# EAGLE design PCBprototyp-Rev3 (EAGLE 9.6.2)
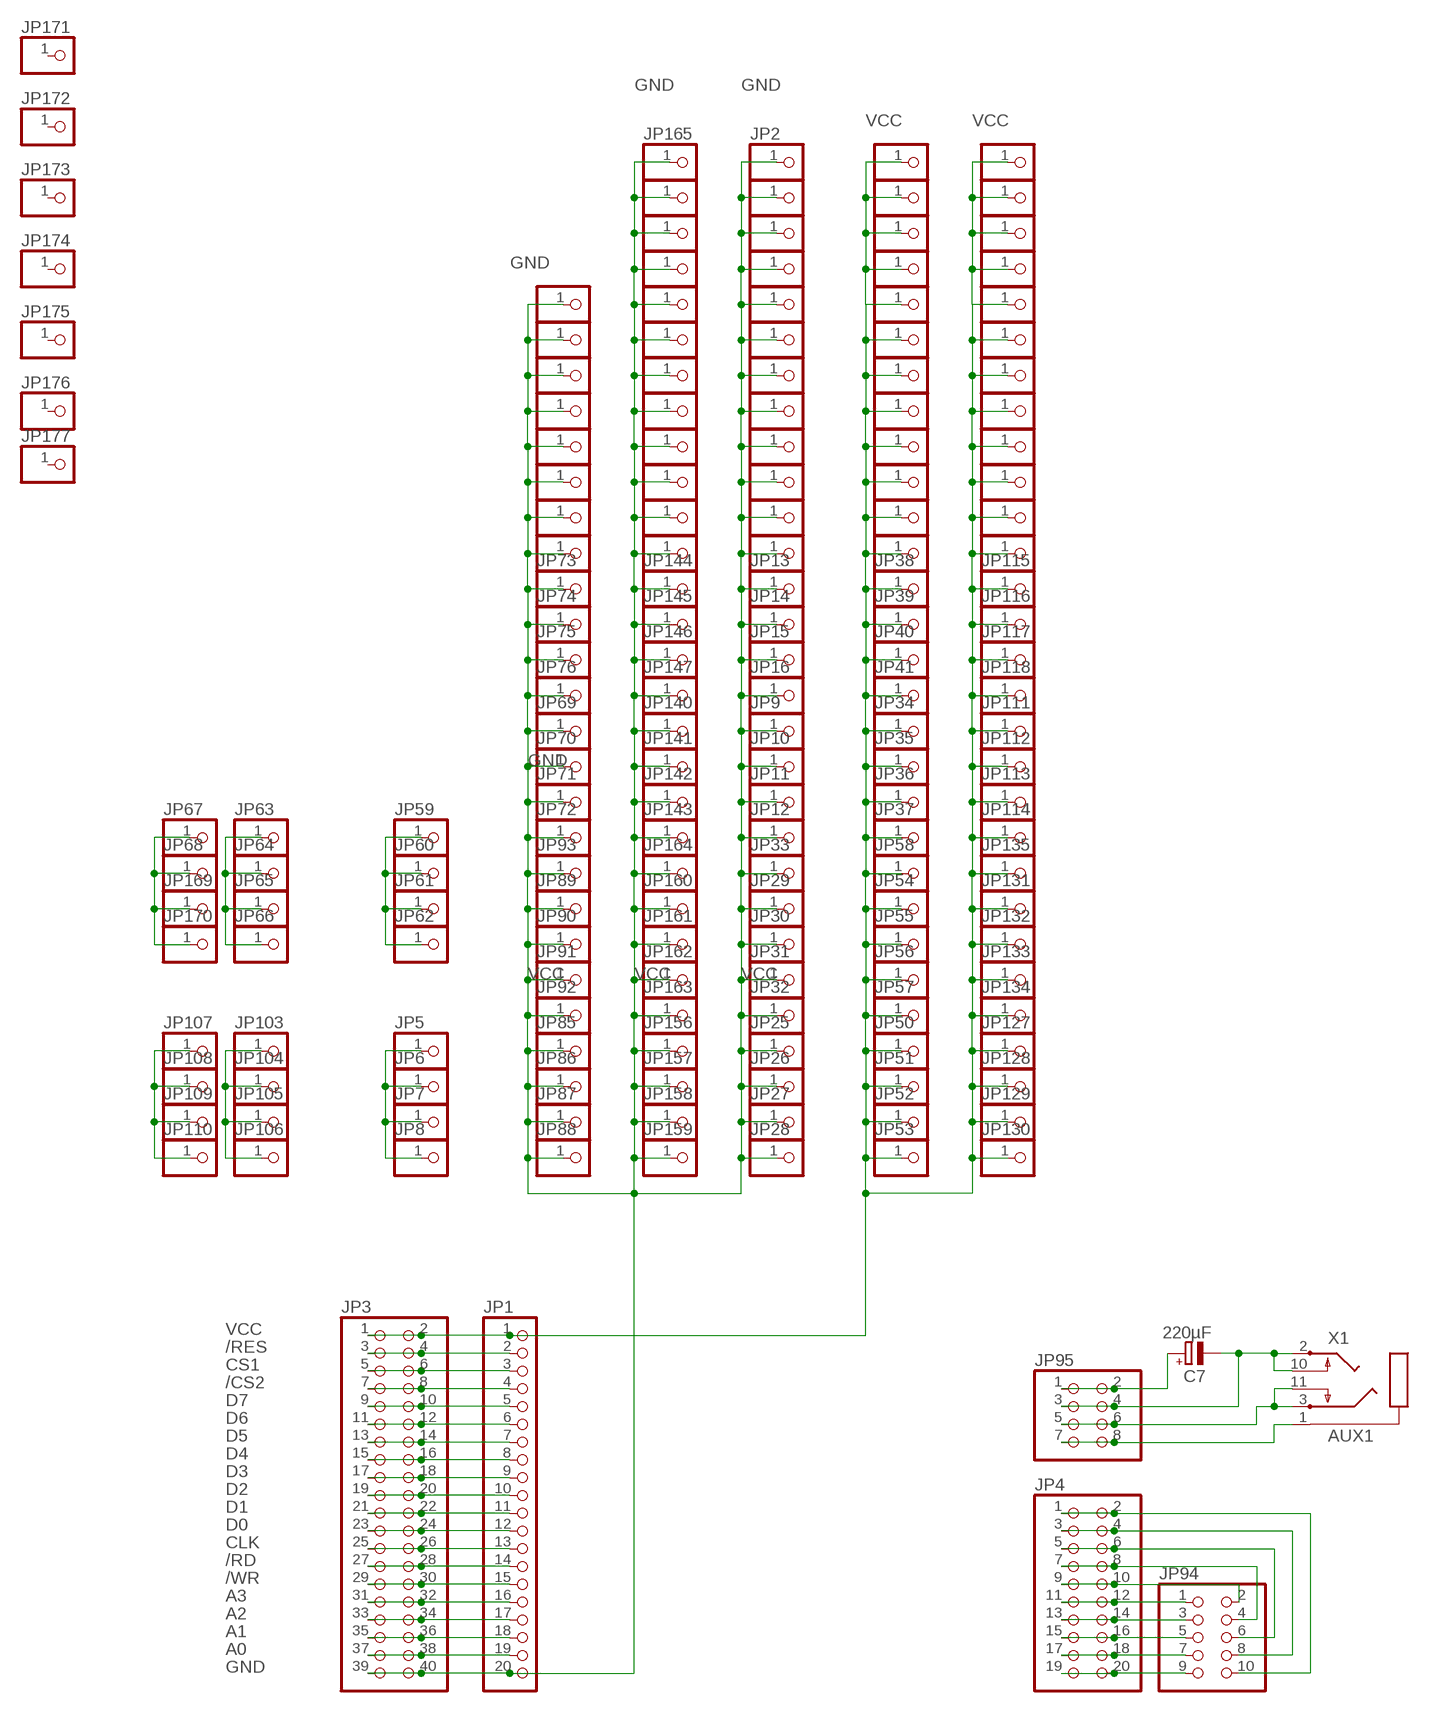
[diagram p0: schematic, sheet 1]

## Parts
C7  220µF  CPOL-EUE2.5-7  [E2,5-7]
JP1  PINHD-1X20  [1X20]
JP2  PINHD-1X1  [1X01]
JP3  PINHD-2X20  [2X20]
JP4  PINHD-2X10  [2X10]
JP5  PINHD-1X1  [1X01]
JP6  PINHD-1X1  [1X01]
JP7  PINHD-1X1  [1X01]
JP8  PINHD-1X1  [1X01]
JP9  PINHD-1X1  [1X01]
JP10  PINHD-1X1  [1X01]
JP11  PINHD-1X1  [1X01]
JP12  PINHD-1X1  [1X01]
JP13  PINHD-1X1  [1X01]
JP14  PINHD-1X1  [1X01]
JP15  PINHD-1X1  [1X01]
JP16  PINHD-1X1  [1X01]
JP17  PINHD-1X1  [1X01]
JP18  PINHD-1X1  [1X01]
JP19  PINHD-1X1  [1X01]
JP20  PINHD-1X1  [1X01]
JP21  PINHD-1X1  [1X01]
JP22  PINHD-1X1  [1X01]
JP23  PINHD-1X1  [1X01]
JP24  PINHD-1X1  [1X01]
JP25  PINHD-1X1  [1X01]
JP26  PINHD-1X1  [1X01]
JP27  PINHD-1X1  [1X01]
JP28  PINHD-1X1  [1X01]
JP29  PINHD-1X1  [1X01]
JP30  PINHD-1X1  [1X01]
JP31  PINHD-1X1  [1X01]
JP32  PINHD-1X1  [1X01]
JP33  PINHD-1X1  [1X01]
JP34  PINHD-1X1  [1X01]
JP35  PINHD-1X1  [1X01]
JP36  PINHD-1X1  [1X01]
JP37  PINHD-1X1  [1X01]
JP38  PINHD-1X1  [1X01]
JP39  PINHD-1X1  [1X01]
JP40  PINHD-1X1  [1X01]
JP41  PINHD-1X1  [1X01]
JP42  PINHD-1X1  [1X01]
JP43  PINHD-1X1  [1X01]
JP44  PINHD-1X1  [1X01]
JP45  PINHD-1X1  [1X01]
JP46  PINHD-1X1  [1X01]
JP47  PINHD-1X1  [1X01]
JP48  PINHD-1X1  [1X01]
JP49  PINHD-1X1  [1X01]
JP50  PINHD-1X1  [1X01]
JP51  PINHD-1X1  [1X01]
JP52  PINHD-1X1  [1X01]
JP53  PINHD-1X1  [1X01]
JP54  PINHD-1X1  [1X01]
JP55  PINHD-1X1  [1X01]
JP56  PINHD-1X1  [1X01]
JP57  PINHD-1X1  [1X01]
JP58  PINHD-1X1  [1X01]
JP59  PINHD-1X1  [1X01]
JP60  PINHD-1X1  [1X01]
JP61  PINHD-1X1  [1X01]
JP62  PINHD-1X1  [1X01]
JP63  PINHD-1X1  [1X01]
JP64  PINHD-1X1  [1X01]
JP65  PINHD-1X1  [1X01]
JP66  PINHD-1X1  [1X01]
JP67  PINHD-1X1  [1X01]
JP68  PINHD-1X1  [1X01]
JP69  PINHD-1X1  [1X01]
JP70  PINHD-1X1  [1X01]
JP71  PINHD-1X1  [1X01]
JP72  PINHD-1X1  [1X01]
JP73  PINHD-1X1  [1X01]
JP74  PINHD-1X1  [1X01]
JP75  PINHD-1X1  [1X01]
JP76  PINHD-1X1  [1X01]
JP77  PINHD-1X1  [1X01]
JP78  PINHD-1X1  [1X01]
JP79  PINHD-1X1  [1X01]
JP80  PINHD-1X1  [1X01]
JP81  PINHD-1X1  [1X01]
JP82  PINHD-1X1  [1X01]
JP83  PINHD-1X1  [1X01]
JP84  PINHD-1X1  [1X01]
JP85  PINHD-1X1  [1X01]
JP86  PINHD-1X1  [1X01]
JP87  PINHD-1X1  [1X01]
JP88  PINHD-1X1  [1X01]
JP89  PINHD-1X1  [1X01]
JP90  PINHD-1X1  [1X01]
JP91  PINHD-1X1  [1X01]
JP92  PINHD-1X1  [1X01]
JP93  PINHD-1X1  [1X01]
JP94  PINHD-2X5  [2X05]
JP95  PINHD-2X4  [2X04]
JP96  PINHD-1X1  [1X01]
JP97  PINHD-1X1  [1X01]
JP98  PINHD-1X1  [1X01]
JP99  PINHD-1X1  [1X01]
JP100  PINHD-1X1  [1X01]
JP101  PINHD-1X1  [1X01]
JP102  PINHD-1X1  [1X01]
JP103  PINHD-1X1  [1X01]
JP104  PINHD-1X1  [1X01]
JP105  PINHD-1X1  [1X01]
JP106  PINHD-1X1  [1X01]
JP107  PINHD-1X1  [1X01]
JP108  PINHD-1X1  [1X01]
JP109  PINHD-1X1  [1X01]
JP110  PINHD-1X1  [1X01]
JP111  PINHD-1X1  [1X01]
JP112  PINHD-1X1  [1X01]
JP113  PINHD-1X1  [1X01]
JP114  PINHD-1X1  [1X01]
JP115  PINHD-1X1  [1X01]
JP116  PINHD-1X1  [1X01]
JP117  PINHD-1X1  [1X01]
JP118  PINHD-1X1  [1X01]
JP119  PINHD-1X1  [1X01]
JP120  PINHD-1X1  [1X01]
JP121  PINHD-1X1  [1X01]
JP122  PINHD-1X1  [1X01]
JP123  PINHD-1X1  [1X01]
JP124  PINHD-1X1  [1X01]
JP125  PINHD-1X1  [1X01]
JP126  PINHD-1X1  [1X01]
JP127  PINHD-1X1  [1X01]
JP128  PINHD-1X1  [1X01]
JP129  PINHD-1X1  [1X01]
JP130  PINHD-1X1  [1X01]
JP131  PINHD-1X1  [1X01]
JP132  PINHD-1X1  [1X01]
JP133  PINHD-1X1  [1X01]
JP134  PINHD-1X1  [1X01]
JP135  PINHD-1X1  [1X01]
JP136  PINHD-1X1  [1X01]
JP137  PINHD-1X1  [1X01]
JP138  PINHD-1X1  [1X01]
JP139  PINHD-1X1  [1X01]
JP140  PINHD-1X1  [1X01]
JP141  PINHD-1X1  [1X01]
JP142  PINHD-1X1  [1X01]
JP143  PINHD-1X1  [1X01]
JP144  PINHD-1X1  [1X01]
JP145  PINHD-1X1  [1X01]
JP146  PINHD-1X1  [1X01]
JP147  PINHD-1X1  [1X01]
JP148  PINHD-1X1  [1X01]
JP149  PINHD-1X1  [1X01]
JP150  PINHD-1X1  [1X01]
JP151  PINHD-1X1  [1X01]
JP152  PINHD-1X1  [1X01]
JP153  PINHD-1X1  [1X01]
JP154  PINHD-1X1  [1X01]
JP155  PINHD-1X1  [1X01]
JP156  PINHD-1X1  [1X01]
JP157  PINHD-1X1  [1X01]
JP158  PINHD-1X1  [1X01]
JP159  PINHD-1X1  [1X01]
JP160  PINHD-1X1  [1X01]
JP161  PINHD-1X1  [1X01]
JP162  PINHD-1X1  [1X01]
JP163  PINHD-1X1  [1X01]
JP164  PINHD-1X1  [1X01]
JP165  PINHD-1X1  [1X01]
JP166  PINHD-1X1  [1X01]
JP167  PINHD-1X1  [1X01]
JP168  PINHD-1X1  [1X01]
JP169  PINHD-1X1  [1X01]
JP170  PINHD-1X1  [1X01]
JP171  PINHD-1X1  [1X01]
JP172  PINHD-1X1  [1X01]
JP173  PINHD-1X1  [1X01]
JP174  PINHD-1X1  [1X01]
JP175  PINHD-1X1  [1X01]
JP176  PINHD-1X1  [1X01]
JP177  PINHD-1X1  [1X01]
X1  AUX1  CON-SJ1-352XNSJ1-352XN  [SJ1-352XN]

## Nets
/CS2: JP1.4 JP3.7 JP3.8
/RD: JP1.14 JP3.27 JP3.28
/RES: JP1.2 JP3.3 JP3.4
/WR: JP1.15 JP3.29 JP3.30
A0: JP1.19 JP3.37 JP3.38
A1: JP1.18 JP3.35 JP3.36
A2: JP1.17 JP3.33 JP3.34
A3: JP1.16 JP3.31 JP3.32
CLK: JP1.13 JP3.25 JP3.26
CS1: JP1.3 JP3.5 JP3.6
D0: JP1.12 JP3.23 JP3.24
D1: JP1.11 JP3.21 JP3.22
D2: JP1.10 JP3.19 JP3.20
D3: JP1.9 JP3.17 JP3.18
D4: JP1.8 JP3.15 JP3.16
D5: JP1.7 JP3.13 JP3.14
D6: JP1.6 JP3.11 JP3.12
D7: JP1.5 JP3.9 JP3.10
GND: JP1.20 JP2.1 JP3.39 JP3.40 JP9.1 JP10.1 JP11.1 JP12.1 JP13.1 JP14.1 JP15.1 JP16.1 JP17.1 JP18.1 JP19.1 JP20.1 JP21.1 JP22.1 JP23.1 JP24.1 JP25.1 JP26.1 JP27.1 JP28.1 JP29.1 JP30.1 JP31.1 JP32.1 JP33.1 JP69.1 JP70.1 JP71.1 JP72.1 JP73.1 JP74.1 JP75.1 JP76.1 JP77.1 JP78.1 JP79.1 JP80.1 JP81.1 JP82.1 JP83.1 JP84.1 JP85.1 JP86.1 JP87.1 JP88.1 JP89.1 JP90.1 JP91.1 JP92.1 JP93.1 JP96.1 JP97.1 JP98.1 JP140.1 JP141.1 JP142.1 JP143.1 JP144.1 JP145.1 JP146.1 JP147.1 JP148.1 JP149.1 JP150.1 JP151.1 JP152.1 JP153.1 JP154.1 JP155.1 JP156.1 JP157.1 JP158.1 JP159.1 JP160.1 JP161.1 JP162.1 JP163.1 JP164.1 JP165.1 JP166.1 JP167.1 JP168.1
N$1: C7.- JP95.3 JP95.4 X1.2 X1.10
N$2: JP95.5 JP95.6 X1.3 X1.11
N$3: JP95.7 JP95.8 X1.1
N$4: C7.+ JP95.1 JP95.2
N$5: JP103.1 JP104.1 JP105.1 JP106.1
N$14: JP5.1 JP6.1 JP7.1 JP8.1
N$15: JP59.1 JP60.1 JP61.1 JP62.1
N$18: JP107.1 JP108.1 JP109.1 JP110.1
N$19: JP63.1 JP64.1 JP65.1 JP66.1
N$20: JP67.1 JP68.1 JP169.1 JP170.1
S1: JP4.11 JP4.12 JP94.1
S2: JP4.9 JP4.10 JP94.2
S3: JP4.13 JP4.14 JP94.3
S4: JP4.7 JP4.8 JP94.4
S5: JP4.15 JP4.16 JP94.5
S6: JP4.5 JP4.6 JP94.6
S7: JP4.17 JP4.18 JP94.7
S8: JP4.3 JP4.4 JP94.8
S9: JP4.19 JP4.20 JP94.9
S10: JP4.1 JP4.2 JP94.10
VCC: JP1.1 JP3.1 JP3.2 JP34.1 JP35.1 JP36.1 JP37.1 JP38.1 JP39.1 JP40.1 JP41.1 JP42.1 JP43.1 JP44.1 JP45.1 JP46.1 JP47.1 JP48.1 JP49.1 JP50.1 JP51.1 JP52.1 JP53.1 JP54.1 JP55.1 JP56.1 JP57.1 JP58.1 JP99.1 JP100.1 JP101.1 JP102.1 JP111.1 JP112.1 JP113.1 JP114.1 JP115.1 JP116.1 JP117.1 JP118.1 JP119.1 JP120.1 JP121.1 JP122.1 JP123.1 JP124.1 JP125.1 JP126.1 JP127.1 JP128.1 JP129.1 JP130.1 JP131.1 JP132.1 JP133.1 JP134.1 JP135.1 JP136.1 JP137.1 JP138.1 JP139.1
Unconnected: JP171.1 JP172.1 JP173.1 JP174.1 JP175.1 JP176.1 JP177.1

## Library data of the parts
C7 = rcl:CPOL-EU: POLARIZED CAPACITOR, European symbol; SPICEPREFIX: C
JP1 = pinhead:PINHD-1X20: PIN HEADER
JP2 JP5-JP93 JP96-JP177 = pinhead:PINHD-1X1: PIN HEADER
JP3 = pinhead:PINHD-2X20: PIN HEADER
JP4 = pinhead:PINHD-2X10: PIN HEADER
JP94 = pinhead:PINHD-2X5: PIN HEADER
JP95 = pinhead:PINHD-2X4: PIN HEADER
X1 = con-sj1-352xn:CON-SJ1-352XN: MIC/HEADPHONE JACK KS-S stereo microphone/headphone jack SJ1-352XN (CUD Devices)

## Net classes
0 default: width 0.254 mm
1 Power: width 0.457 mm

## Board
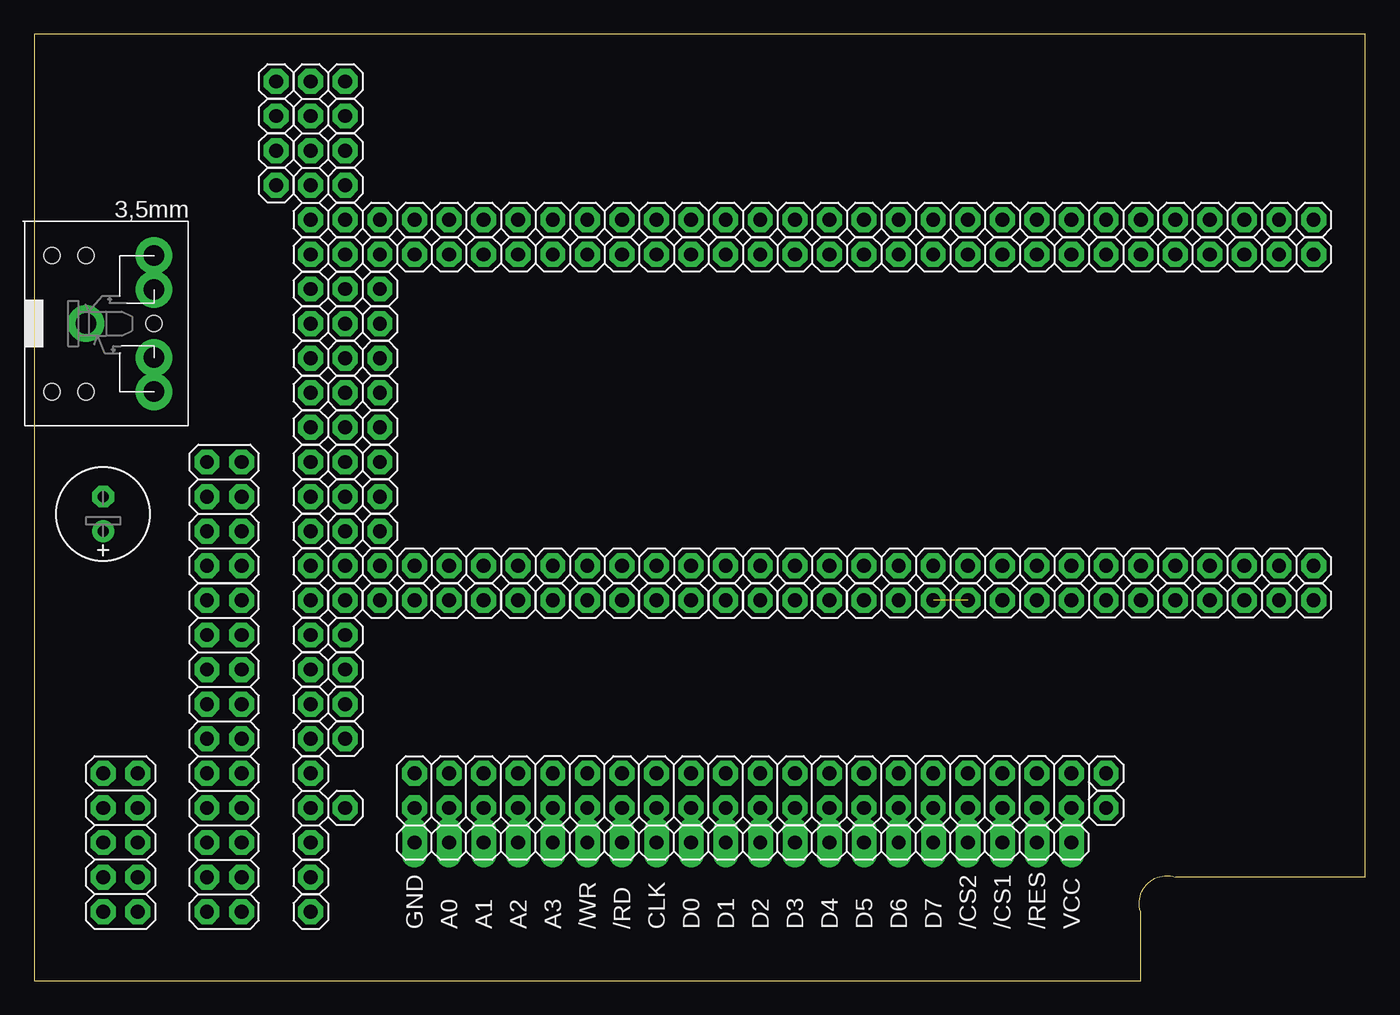
[diagram p1: board, top side]
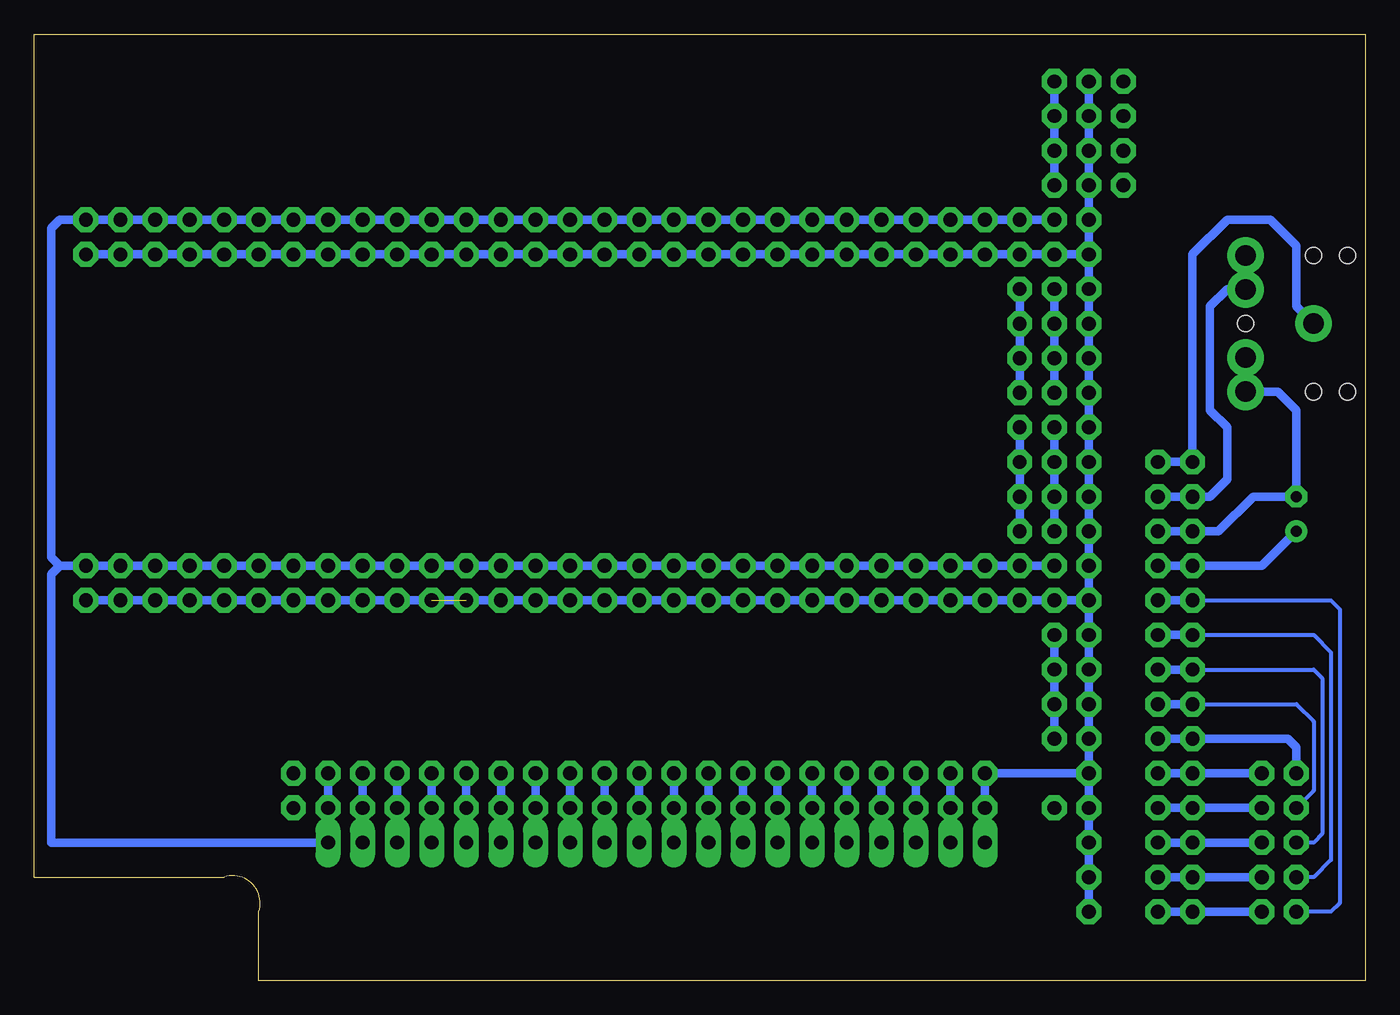
[diagram p2: board, bottom side, seen from below]

Size 97.79 x 69.52 mm. Coordinates in mm from the lower left corner, seen from the top.
Outline: 97.77,7.62 97.77,69.52 0,69.52 0,0 81.28,0 81.28,5.08 arc-127 83.82,7.62 97.79,7.62
Copper layers (1*16): Top 0.035mm / dielectric 1.6mm / Bottom 0.035mm
Design rules "jlcpcb-2layers": minimum track width 5mil, minimum drill 0.3mm, track to track 5mil, track to pad 5mil, pad to pad 5mil, via to via 5mil, smd to smd 5mil, copper to edge 0.2mm, drill to drill 6mil, minimum pad ring 10mil, minimum via ring 3mil, stop-mask expansion 4mil, vias tented up to drill 0mil, thermal gap 10mil

### Footprints (pad centres in the part's own frame; a part is rotated, then mirrored left to right if it is on the bottom)
E2,5-7 = drill 0.813 pad 1.6: + -1.27,0 | drill 0.813 pad 1.6 octagon: - 1.27,0
1X20 = drill 1.016 long: 1 -24.13,0; 2 -21.59,0; 3 -19.05,0; 4 -16.51,0; 5 -13.97,0; 6 -11.43,0; 7 -8.89,0; 8 -6.35,0; 9 -3.81,0; 10 -1.27,0; 11 1.27,0; 12 3.81,0; 13 6.35,0; 14 8.89,0; 15 11.43,0; 16 13.97,0; 17 16.51,0; 18 19.05,0; 19 21.59,0; 20 24.13,0
1X01 = drill 1.016 octagon: 1 0,0
2X20 = drill 1.016 octagon: 1 -24.13,-1.27; 2 -24.13,1.27; 3 -21.59,-1.27; 4 -21.59,1.27; 5 -19.05,-1.27; 6 -19.05,1.27; 7 -16.51,-1.27; 8 -16.51,1.27; 9 -13.97,-1.27; 10 -13.97,1.27; 11 -11.43,-1.27; 12 -11.43,1.27; 13 -8.89,-1.27; 14 -8.89,1.27; 15 -6.35,-1.27; 16 -6.35,1.27; 17 -3.81,-1.27; 18 -3.81,1.27; 19 -1.27,-1.27; 20 -1.27,1.27; 21 1.27,-1.27; 22 1.27,1.27; 23 3.81,-1.27; 24 3.81,1.27; 25 6.35,-1.27; 26 6.35,1.27; 27 8.89,-1.27; 28 8.89,1.27; 29 11.43,-1.27; 30 11.43,1.27; 31 13.97,-1.27; 32 13.97,1.27; 33 16.51,-1.27; 34 16.51,1.27; 35 19.05,-1.27; 36 19.05,1.27; 37 21.59,-1.27; 38 21.59,1.27; 39 24.13,-1.27; 40 24.13,1.27
2X10 = drill 1.016 octagon: 1 -11.43,-1.27; 2 -11.43,1.27; 3 -8.89,-1.27; 4 -8.89,1.27; 5 -6.35,-1.27; 6 -6.35,1.27; 7 -3.81,-1.27; 8 -3.81,1.27; 9 -1.27,-1.27; 10 -1.27,1.27; 11 1.27,-1.27; 12 1.27,1.27; 13 3.81,-1.27; 14 3.81,1.27; 15 6.35,-1.27; 16 6.35,1.27; 17 8.89,-1.27; 18 8.89,1.27; 19 11.43,-1.27; 20 11.43,1.27
2X05 = drill 1.016 octagon: 1 -5.08,-1.27; 2 -5.08,1.27; 3 -2.54,-1.27; 4 -2.54,1.27; 5 0,-1.27; 6 0,1.27; 7 2.54,-1.27; 8 2.54,1.27; 9 5.08,-1.27; 10 5.08,1.27
2X04 = drill 1.016 octagon: 1 -3.81,-1.27; 2 -3.81,1.27; 3 -1.27,-1.27; 4 -1.27,1.27; 5 1.27,-1.27; 6 1.27,1.27; 7 3.81,-1.27; 8 3.81,1.27
SJ1-352XN = drill 1.5 pad 2.184: 1 0,0; 2 5,-5; 3 5,5; 10 5,-2.5; 11 5,2.5 | hole 1.2: 5,0; 0,5; 0,-5; -2.5,-5; -2.5,5

### Placement (x,y rotation side)
C7  5.08,34.29 90 top
JP1  52.07,10.16 180 top
JP2  93.98,27.94 0 top
JP3  52.07,13.97 180 top
JP4  13.97,16.51 90 top
JP5  22.86,25.4 0 top
JP6  22.86,22.86 0 top
JP7  22.86,20.32 0 top
JP8  22.86,17.78 0 top
JP9  33.02,27.94 90 top
JP10  22.86,27.94 90 top
JP11  27.94,27.94 90 top
JP12  25.4,27.94 90 top
JP13  30.48,27.94 90 top
JP14  35.56,27.94 90 top
JP15  38.1,27.94 90 top
JP16  40.64,27.94 90 top
JP17  43.18,27.94 90 top
JP18  45.72,27.94 90 top
JP19  48.26,27.94 90 top
JP20  50.8,27.94 90 top
JP21  53.34,27.94 90 top
JP22  55.88,27.94 90 top
JP23  58.42,27.94 90 top
JP24  60.96,27.94 90 top
JP25  66.04,27.94 0 top
JP26  63.5,27.94 0 top
JP27  71.12,27.94 0 top
JP28  68.58,27.94 0 top
JP29  73.66,27.94 0 top
JP30  76.2,27.94 0 top
JP31  78.74,27.94 0 top
JP32  81.28,27.94 0 top
JP33  83.82,27.94 0 top
JP34  43.18,30.48 0 top
JP35  53.34,30.48 0 top
JP36  63.5,30.48 0 top
JP37  66.04,30.48 0 top
JP38  83.82,30.48 0 top
JP39  40.64,30.48 0 top
JP40  50.8,30.48 0 top
JP41  60.96,30.48 0 top
JP42  68.58,30.48 0 top
JP43  81.28,30.48 0 top
JP44  38.1,30.48 0 top
JP45  48.26,30.48 0 top
JP46  58.42,30.48 0 top
JP47  71.12,30.48 0 top
JP48  78.74,30.48 0 top
JP49  35.56,30.48 0 top
JP50  45.72,30.48 0 top
JP51  55.88,30.48 0 top
JP52  73.66,30.48 0 top
JP53  76.2,30.48 0 top
JP54  22.86,30.48 0 top
JP55  25.4,30.48 0 top
JP56  27.94,30.48 0 top
JP57  30.48,30.48 0 top
JP58  33.02,30.48 0 top
JP59  22.86,33.02 0 top
JP60  22.86,35.56 0 top
JP61  22.86,38.1 0 top
JP62  22.86,40.64 0 top
JP63  22.86,63.5 0 top
JP64  22.86,60.96 0 top
JP65  22.86,58.42 0 top
JP66  22.86,66.04 0 top
JP67  22.86,45.72 0 top
JP68  22.86,43.18 0 top
JP69  20.32,15.24 90 top
JP70  20.32,12.7 90 top
JP71  20.32,58.42 90 top
JP72  20.32,7.62 0 top
JP73  20.32,5.08 0 top
JP74  20.32,66.04 90 top
JP75  20.32,63.5 90 top
JP76  20.32,60.96 90 top
JP77  20.32,10.16 0 top
JP78  20.32,55.88 0 top
JP79  20.32,43.18 0 top
JP80  20.32,45.72 0 top
JP81  20.32,48.26 0 top
JP82  20.32,50.8 0 top
JP83  20.32,53.34 0 top
JP84  20.32,30.48 0 top
JP85  20.32,33.02 0 top
JP86  20.32,35.56 0 top
JP87  20.32,38.1 0 top
JP88  20.32,40.64 0 top
JP89  20.32,27.94 0 top
JP90  20.32,25.4 0 top
JP91  20.32,22.86 0 top
JP92  20.32,20.32 0 top
JP93  20.32,17.78 0 top
JP94  6.35,10.16 270 top
JP95  13.97,34.29 90 top
JP96  88.9,27.94 0 top
JP97  86.36,27.94 0 top
JP98  91.44,27.94 0 top
JP99  88.9,30.48 0 top
JP100  93.98,30.48 0 top
JP101  86.36,30.48 0 top
JP102  91.44,30.48 0 top
JP103  25.4,33.02 0 top
JP104  25.4,35.56 0 top
JP105  25.4,38.1 0 top
JP106  25.4,40.64 0 top
JP107  25.4,43.18 0 top
JP108  25.4,45.72 0 top
JP109  25.4,48.26 0 top
JP110  25.4,50.8 0 top
JP111  53.34,55.88 0 top
JP112  60.96,55.88 0 top
JP113  55.88,55.88 0 top
JP114  50.8,55.88 0 top
JP115  45.72,55.88 0 top
JP116  43.18,55.88 0 top
JP117  40.64,55.88 0 top
JP118  38.1,55.88 0 top
JP119  35.56,55.88 0 top
JP120  91.44,55.88 0 top
JP121  93.98,55.88 0 top
JP122  22.86,55.88 0 top
JP123  25.4,55.88 0 top
JP124  88.9,55.88 0 top
JP125  86.36,55.88 0 top
JP126  83.82,55.88 0 top
JP127  27.94,55.88 0 top
JP128  76.2,55.88 0 top
JP129  78.74,55.88 0 top
JP130  81.28,55.88 0 top
JP131  30.48,55.88 0 top
JP132  73.66,55.88 0 top
JP133  71.12,55.88 0 top
JP134  68.58,55.88 0 top
JP135  33.02,55.88 0 top
JP136  63.5,55.88 0 top
JP137  66.04,55.88 0 top
JP138  58.42,55.88 0 top
JP139  48.26,55.88 0 top
JP140  83.82,53.34 0 top
JP141  81.28,53.34 0 top
JP142  91.44,53.34 0 top
JP143  93.98,53.34 0 top
JP144  76.2,53.34 0 top
JP145  78.74,53.34 0 top
JP146  88.9,53.34 0 top
JP147  86.36,53.34 0 top
JP148  68.58,53.34 0 top
JP149  71.12,53.34 0 top
JP150  73.66,53.34 0 top
JP151  43.18,53.34 0 top
JP152  66.04,53.34 0 top
JP153  63.5,53.34 0 top
JP154  60.96,53.34 0 top
JP155  40.64,53.34 0 top
JP156  53.34,53.34 0 top
JP157  55.88,53.34 0 top
JP158  58.42,53.34 0 top
JP159  38.1,53.34 0 top
JP160  50.8,53.34 0 top
JP161  48.26,53.34 0 top
JP162  45.72,53.34 0 top
JP163  35.56,53.34 0 top
JP164  25.4,53.34 0 top
JP165  27.94,53.34 0 top
JP166  30.48,53.34 0 top
JP167  33.02,53.34 0 top
JP168  22.86,53.34 0 top
JP169  22.86,50.8 0 top
JP170  22.86,48.26 0 top
JP171  78.74,12.7 0 top
JP172  22.86,12.7 0 top
JP173  17.78,66.04 0 top
JP174  17.78,63.5 0 top
JP175  78.74,15.24 0 top
JP176  17.78,60.96 0 top
JP177  17.78,58.42 0 top
X1  3.81,48.26 0 top

### Tracks (layer width: path | path; a pad name or v marks a point on that pad's centre or on a via)
/CS2
  Bottom 0.61: JP1.4 JP3.8 JP3.7
/RD
  Bottom 0.61: JP1.14 JP3.28 JP3.27
/RES
  Bottom 0.61: JP1.2 JP3.4 JP3.3
/WR
  Bottom 0.61: JP1.15 JP3.30 JP3.29
A0
  Bottom 0.61: JP1.19 JP3.38 JP3.37
A1
  Bottom 0.61: JP1.18 JP3.36 JP3.35
A2
  Bottom 0.61: JP1.17 JP3.34 JP3.33
A3
  Bottom 0.61: JP1.16 JP3.32 JP3.31
CLK
  Bottom 0.61: JP1.13 JP3.26 JP3.25
CS1
  Bottom 0.61: JP1.3 JP3.6 JP3.5
D0
  Bottom 0.61: JP1.12 JP3.24 JP3.23
D1
  Bottom 0.61: JP1.11 JP3.22 JP3.21
D2
  Bottom 0.61: JP1.10 JP3.20 JP3.19
D3
  Bottom 0.61: JP1.9 JP3.18 JP3.17
D4
  Bottom 0.61: JP1.8 JP3.16 JP3.15
D5
  Bottom 0.61: JP1.7 JP3.14 JP3.13
D6
  Bottom 0.61: JP1.6 JP3.12 JP3.11
D7
  Bottom 0.61: JP1.5 JP3.10 JP3.9
GND  (1 unrouted)
  Bottom 0.61: JP1.20 JP3.40 JP3.39 JP69.1 | JP73.1 JP72.1 JP77.1 JP70.1 JP69.1 | JP69.1 JP93.1 JP92.1 JP91.1 JP90.1 JP89.1 | JP89.1 JP84.1 JP85.1 JP86.1 JP87.1 JP88.1 JP79.1 JP80.1 JP81.1 JP82.1 JP83.1 | JP83.1 JP78.1 JP71.1 JP76.1 JP75.1 JP74.1 | JP83.1 JP168.1 JP164.1 JP165.1 JP166.1 JP167.1 JP163.1 JP159.1 JP155.1 JP151.1 JP162.1 JP161.1 JP160.1 JP156.1 JP157.1 JP158.1 JP154.1 JP153.1 JP152.1 JP148.1 JP149.1 JP150.1 JP144.1 JP145.1 JP141.1 JP140.1 JP147.1 JP146.1 JP142.1 JP143.1 | JP2.1 JP98.1 JP96.1 JP97.1 JP33.1 JP32.1 JP31.1 JP30.1 JP29.1 JP27.1 JP28.1 JP26.1 JP24.1 JP23.1 JP22.1 JP21.1 JP20.1 JP19.1 JP18.1 JP17.1 JP16.1 JP15.1 JP14.1 JP9.1 JP13.1 JP11.1 JP12.1 JP10.1 JP89.1
N$1
  Bottom 0.61: JP95.3 JP95.4 10.79,33.02 8.26,35.56 C7.- 5.08,41.91 6.43,43.26 X1.2 X1.10
N$2
  Bottom 0.61: JP95.5 JP95.6 11.43,35.56 10.16,36.83 10.16,40.64 11.43,41.91 11.43,49.53 10.16,50.8 8.85,50.8 X1.11 X1.3
N$3
  Bottom 0.61: JP95.7 JP95.8 12.7,53.34 10.16,55.88 6.99,55.88 5.08,53.98 5.08,49.53 X1.1
N$4
  Bottom 0.61: JP95.1 JP95.2 7.62,30.48 C7.+
N$5
  Bottom 0.61: JP103.1 JP104.1 JP105.1 JP106.1
N$14
  Bottom 0.61: JP8.1 JP7.1 JP6.1 JP5.1
N$15
  Bottom 0.61: JP62.1 JP61.1 JP60.1 JP59.1
N$18
  Bottom 0.61: JP107.1 JP108.1 JP109.1 JP110.1
N$19
  Bottom 0.61: JP65.1 JP64.1 JP63.1 JP66.1
N$20
  Bottom 0.61: JP169.1 JP170.1 JP67.1 JP68.1
S1
  Bottom 0.61: JP4.11 JP4.12 5.71,17.78 5.08,17.14 JP94.1
S2
  Bottom 0.61: JP94.2 JP4.10 JP4.9
S3
  Bottom 0.305: JP4.14 5.08,20.32 3.81,19.05 3.81,13.97 JP94.3
  Bottom 0.61: JP4.13 JP4.14
S4
  Bottom 0.61: JP4.7 JP4.8 JP94.4
S5
  Bottom 0.305: JP4.16 3.81,22.86 3.17,22.23 3.17,10.79 3.81,10.16 JP94.5
  Bottom 0.61: JP4.15 JP4.16
S6
  Bottom 0.61: JP94.6 JP4.6 JP4.5
S7
  Bottom 0.305: JP4.18 3.81,25.4 2.54,24.13 2.54,8.89 3.81,7.62 JP94.7
  Bottom 0.61: JP4.17 JP4.18
S8
  Bottom 0.61: JP4.3 JP4.4 JP94.8
S9
  Bottom 0.305: JP4.20 2.54,27.94 1.91,27.3 1.91,5.71 2.54,5.08 JP94.9
  Bottom 0.61: JP4.19 JP4.20
S10
  Bottom 0.61: JP94.10 JP4.2 JP4.1
VCC
  Bottom 0.61: JP3.1 JP3.2 JP1.1 96.52,10.16 96.52,29.84 95.89,30.48 | 95.89,30.48 96.52,31.11 96.52,55.24 95.89,55.88 JP121.1 JP120.1 JP124.1 JP125.1 JP126.1 JP130.1 JP129.1 JP128.1 JP132.1 JP133.1 JP134.1 JP137.1 JP136.1 JP112.1 JP138.1 JP113.1 JP111.1 JP114.1 JP139.1 JP115.1 JP116.1 JP117.1 JP118.1 JP119.1 JP135.1 JP131.1 JP127.1 JP123.1 JP122.1 | 95.89,30.48 JP100.1 JP102.1 JP99.1 JP101.1 JP38.1 JP43.1 JP48.1 JP53.1 JP52.1 JP47.1 JP42.1 JP37.1 JP36.1 JP41.1 JP46.1 JP51.1 JP35.1 JP40.1 JP45.1 JP50.1 JP34.1 JP39.1 JP44.1 JP49.1 JP58.1 JP57.1 JP56.1 JP55.1 JP54.1

### Text on the board
tPlace: GND | A0 | A1 | A2 | A3 | /WR | /RD | CLK | D0 | D1 | D2 | D3 | D4 | D5 | D6 | D7 | /CS2 | /CS1 | /RES | VCC
tValues: 9 | 7 | 5 | 3 | 1 | 2 | 4 | 6 | 8 | 10